# Altium schematic sheet 06_RPI_USB.SchDoc
size A3; Revision: A
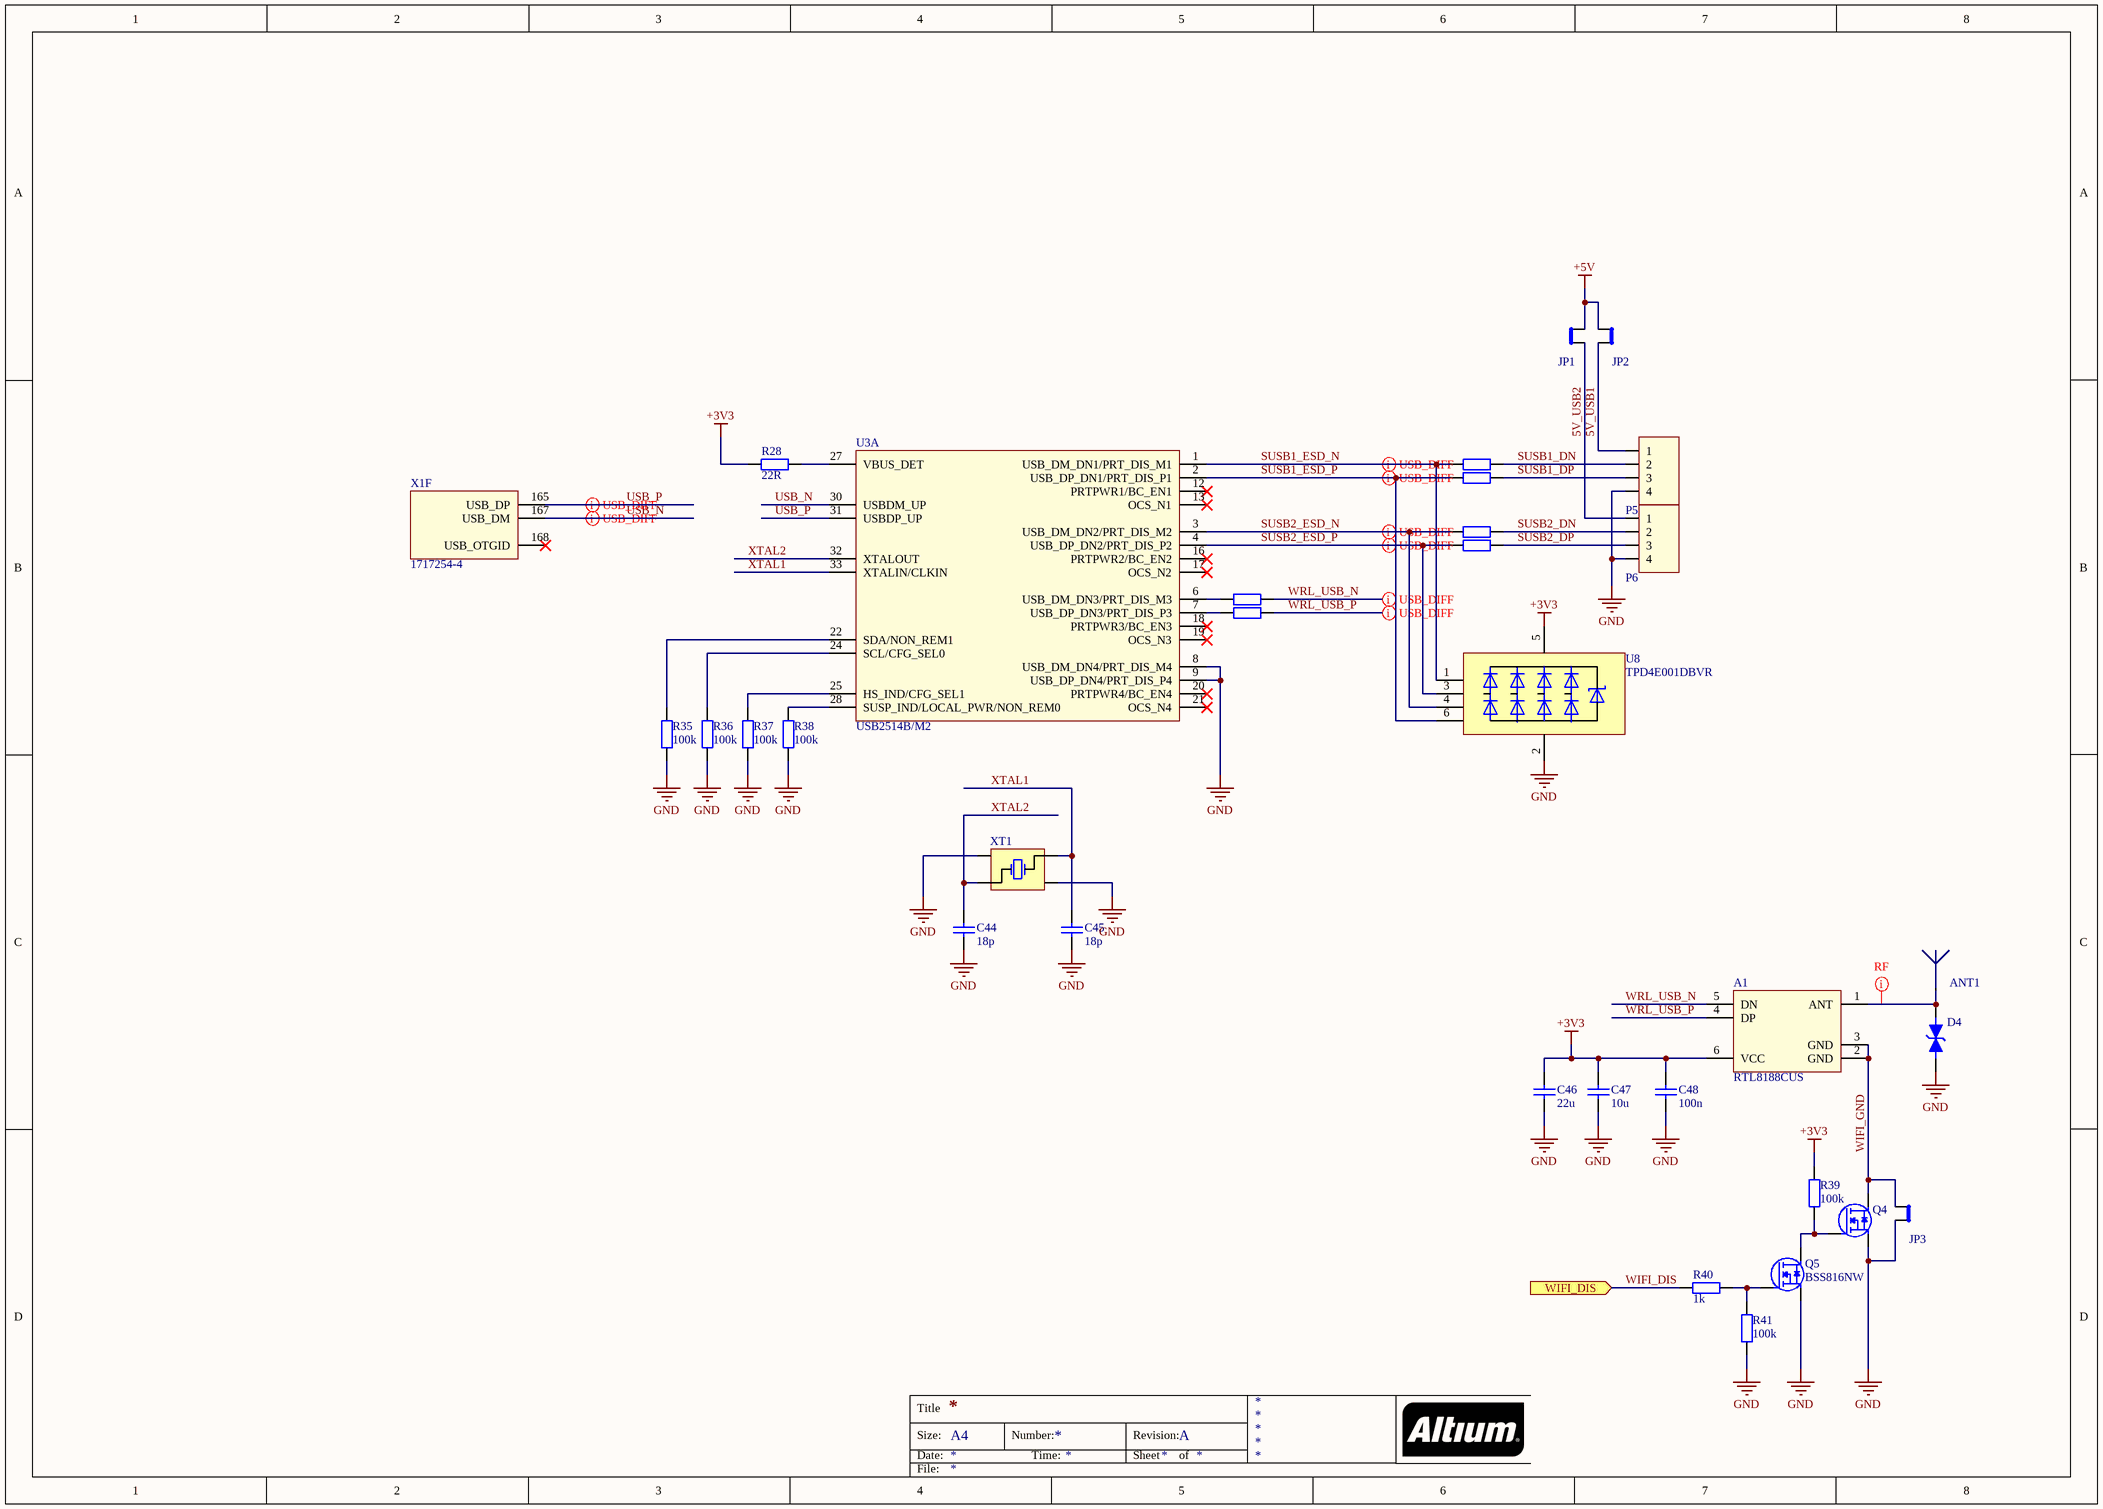
[diagram p0: 06_RPI_USB.SchDoc]

## Parts
A1  RTL8188CUS  [RTL8188]
ANT1  ANT7020LL05R2400A  [ANT7020LL05]  (value not drawn)
C44  18p  [C0603_IPC_HD]
C45  18p  [C0603_IPC_HD]
C46  22u  [C0805_IPC_HD]
C47  10u  [C0805_IPC_HD]
C48  100n  [C0603_IPC_HD]
D4  LXES15AAA1-153  [C0402_IPC_MD]  (value not drawn)
JP1  Jumper  [SolderHump1]  (value not drawn)  (no BOM)
JP2  Jumper  [SolderHump1]  (value not drawn)  (no BOM)
JP3  Jumper  [SolderHump1]  (value not drawn)  (no BOM)
P5  PicoBlade_4R  [PB_53261-0471_Right]  (value not drawn)
P6  PicoBlade_4R  [PB_53261-0471_Right]  (value not drawn)
Q4  DMG2302UK-7  [SOT23]  (value not drawn)
Q5  BSS816NW  [SOT323]
R28  22R  [R0603_IPC_MD]
R29  22R  [R0603_IPC_MD]  (value not drawn)
R30  22R  [R0603_IPC_MD]  (value not drawn)
R31  22R  [R0603_IPC_MD]  (value not drawn)
R32  22R  [R0603_IPC_MD]  (value not drawn)
R33  22R  [R0603_IPC_MD]  (value not drawn)
R34  22R  [R0603_IPC_MD]  (value not drawn)
R35  100k  [R0603_IPC_MD]
R36  100k  [R0603_IPC_MD]
R37  100k  [R0603_IPC_MD]
R38  100k  [R0603_IPC_MD]
R39  100k  [R0603_IPC_MD]
R40  1k  [R0603_IPC_MD]
R41  100k  [R0603_IPC_MD]
U3  USB2514B/M2  [QFN36]  (part A of 2)
U8  TPD4E001DBVR  [SOT23-6]
X1  1717254-4  [1717254-1]  (part F of 7)
XT1  TSX-3225-24.0000MF15X-AC6  [3.2x2.5_4pad_smd]  (value not drawn)

## Ports
WIFI_DIS (in)

## Nets
+3V3: A1.6(VCC) C46.1 C47.2 C48.2 R28.1 R39.2 U8.5(VCC)
+5V: JP1.2 JP2.2
GND: C44.1 C45.1 C46.2 C47.1 C48.1 D4.1 JP3.1 P5.4 P6.4 Q4.2(S) Q5.2(S) R35.1 R36.1 R37.1 R38.1 R41.1 U3.8(USB_DM_DN4/PRT_DIS_M4) U3.9(USB_DP_DN4/PRT_DIS_P4) U8.2(GND) XT1.2(NC) XT1.4(NC)
5V_USB1: JP2.1 P5.1
5V_USB2: JP1.1 P6.1
SUSB1_DN: P5.2 R29.2
SUSB1_DP: P5.3 R30.2
SUSB1_ESD_N: R29.1 U3.1(USB_DM_DN1/PRT_DIS_M1) U8.1(IO1)
SUSB1_ESD_P: R30.1 U3.2(USB_DP_DN1/PRT_DIS_P1) U8.6(IO4)
SUSB2_DN: P6.2 R31.2
SUSB2_DP: P6.3 R32.2
SUSB2_ESD_N: R31.1 U3.3(USB_DM_DN2/PRT_DIS_M2) U8.4(IO3)
SUSB2_ESD_P: R32.1 U3.4(USB_DP_DN2/PRT_DIS_P2) U8.3(IO2)
USB_N: U3.30(USBDM_UP) X1.167(USB_DM)
USB_P: U3.31(USBDP_UP) X1.165(USB_DP)
WIFI_DIS: R40.1 ; port WIFI_DIS
WIFI_GND: A1.2(GND) A1.3(GND) JP3.2 Q4.3(D)
WRL_USB_N: A1.5(DN) R33.2
WRL_USB_P: A1.4(DP) R34.2
XTAL1: C45.2 U3.33(XTALIN/CLKIN) XT1.1(OSC1)
XTAL2: C44.2 U3.32(XTALOUT) XT1.3(OSC2)
NetA1_1: A1.1(ANT) ANT1.1 D4.2
NetQ4_1: Q4.1(G) Q5.3(D) R39.1
NetQ5_1: Q5.1(G) R40.2 R41.2
NetR28_2: R28.2 U3.27(VBUS_DET)
NetR33_1: R33.1 U3.6(USB_DM_DN3/PRT_DIS_M3)
NetR34_1: R34.1 U3.7(USB_DP_DN3/PRT_DIS_P3)
NetR35_2: R35.2 U3.22(SDA/NON_REM1)
NetR36_2: R36.2 U3.24(SCL/CFG_SEL0)
NetR37_2: R37.2 U3.25(HS_IND/CFG_SEL1)
NetR38_2: R38.2 U3.28(SUSP_IND/LOCAL_PWR/NON_REM0)

Not connected (* = marked no-connect by the designer): U3 12(PRTPWR1/BC_EN1)* 13(OCS_N1)* 16(PRTPWR2/BC_EN2)* 17(OCS_N2)* 18(PRTPWR3/BC_EN3)* 19(OCS_N3)* 20(PRTPWR4/BC_EN4)* 21(OCS_N4)*; X1 168(USB_OTGID)*

## Layout directives
net class RF: NetA1_1
differential pair: SUSB1_ESD_N, SUSB1_ESD_P, SUSB2_ESD_N, SUSB2_ESD_P, USB_N, USB_P, WRL_USB_N, WRL_USB_P

## Notes on the sheet
- Title
- Size:
- Date:
- A4
- Number:
- Time:
- Revision:
- Sheet
- of
- File:

## Library data of the parts
A1 = RTL8188CUS: USB WiFi module; Manufacturer: China; Manufacturer Part Number: RTL8188CUS; Supplier 1: Aliexpress; Supplier Part Number 1: RTL8188CUS
ANT1 = ANT7020LL05R2400A: RF ANT 2.4GHZ CHIP SOLDER SMD; Manufacturer: Yageo; Manufacturer Part Number: ANT7020LL05R2400A; Supplier 1: Digi-Key; Supplier Part Number 1: 311-1549-1-ND
C44 C45 = CL10C180JB8NNNC: CAP CER 18PF 50V C0G/NP0 0603; Manufacturer: Samsung Electro-Mechanics; Manufacturer Part Number: CL10C180JB8NNNC; Voltage: 50V; Value: 18p; Dielectric: C0G/NP0; Supplier 1: Digi-Key; Supplier Part Number 1: 1276-1089-1-ND
C46 = CL21A226MOCLRNC: CAP CER 22UF 16V X5R 0805; Manufacturer: Samsung Electro-Mechanics; Manufacturer Part Number: CL21A226MOCLRNC; Voltage: 16V; Value: 22u; Dielectric: X5R; Supplier 1: Digi-Key; Supplier Part Number 1: 1276-6780-1-ND
C47 = CL21B106KOQNNNG: CAP CER 10UF 16V X7R 0805; Manufacturer: Samsung Electro-Mechanics; Manufacturer Part Number: CL21B106KOQNNNG; Voltage: 16V; Value: 10u; Dielectric: X7R; Supplier 1: Digi-Key; Supplier Part Number 1: 1276-6472-1-ND
C48 = CL10B104KO8NNNC: CAP CER 0.1UF 16V X7R 0603; Manufacturer: Samsung Electro-Mechanics; Manufacturer Part Number: CL10B104KO8NNNC; Voltage: 16V; Value: 100n; Dielectric: X7R; Supplier 1: Digi-Key; Supplier Part Number 1: 1276-1005-1-ND
D4 = LXES15AAA1-153: TVS DIODE 4V 0402; Manufacturer: Murata Electronics North America; Manufacturer Part Number: LXES15AAA1-153; Voltage - Reverse Standoff (Typ): 4V; Supplier 1: Digi-Key; Supplier Part Number 1: 490-13210-1-ND
JP1-JP3 = Jumper: Jumper 2.54mm 1 pos; Manufacturer: *; Manufacturer Part Number: *
P5 P6 = PicoBlade_4R: Connector Header Surface Mount 4 position 0.049" (1.25mm); Manufacturer: China; Manufacturer Part Number: PicoBlade_4R; Supplier 1: Aliexpress; Supplier Part Number 1: PicoBlade_4R
Q4 = DMG2302: N-Channel Logic Level Enhancement Mode Field Effect Transistor; Manufacturer: Diodes Incorporated; Manufacturer Part Number: DMG2302UK-7; Supplier 1: Digi-Key; Supplier Part Number 1: DMG2302UK-7DICT-ND
Q5 = BSS816: N-Channel Logic Level Enhancement Mode Field Effect Transistor; Manufacturer: Infineon Technologies; Manufacturer Part Number: BSS816NW; Supplier 1: Digi-Key; Supplier Part Number 1: BSS816NWH6327XTSA1CT-ND
R28-R34 = CR0603-JW-220ELF: RES SMD 22 OHM 5% 1/10W 0603; Manufacturer: Bourns Inc.; Value: 22R; Tolarance: 5%; Manufacturer Part Number: CR0603-JW-220ELF; Supplier 1: Digi-Key; Supplier Part Number 1: CR0603-JW-220ELFCT-ND
R35-R39 R41 = RMCF0603FT100K: RES 100K OHM 1% 1/10W 0603; Manufacturer: Bourns Inc.; Value: 100k; Tolarance: 1%; Manufacturer Part Number: RMCF0603FT100K; Supplier 1: Digi-Key; Supplier Part Number 1: RMCF0603FT100KCT-ND
R40 = CR0603-JW-102ELF: RES SMD 1K OHM 5% 1/10W 0603; Manufacturer: Bourns Inc.; Value: 1k; Tolarance: 5%; Manufacturer Part Number: CR0603-JW-102ELF; Supplier 1: Digi-Key; Supplier Part Number 1: CR0603-JW-102ELFCT-ND
U3 = USB2514B/M2: IC HUB CTLR 4PORT USB 2.0 HS 36S; Manufacturer: Microchip Technology; Manufacturer Part Number: USB2514B/M2; Supplier 1: Digi-Key; Supplier Part Number 1: USB2514B/M2-ND
U8 = TPD4E001DBVR: 4x TVS DIODE 5.5V SOT23-6; Manufacturer: TI; Manufacturer Part Number: TPD4E001DBVR; Supplier 1: Digi-Key; Supplier Part Number 1: 296-28203-1-ND
X1 = Raspberry CM Connector: CONN SKT SODIMM 200POS R/A SMD; Manufacturer: TE Connectivity AMP Connectors; Manufacturer Part Number: 1717254-4; Supplier 1: Digi-Key; Supplier Part Number 1: A130932CT-ND
XT1 = TSX-3225-24.0000MF15X-AC61: CRYSTAL 24.00 MHZ 9.0PF SMD; Manufacturer: EPSON; Value: 24 MHz; Manufacturer Part Number: TSX-3225-24.0000MF15X-AC6; Supplier 1: Digi-Key; Supplier Part Number 1: SER4180CT-ND